# Altium schematic sheet Main.SchDoc: BTL Siuuuu Cao Tần
size A3; Author: Lý Đoàn Dự; DocumentNumber: 1; Revision: 0.0.1; SheetNumber: 1; SheetTotal: 1
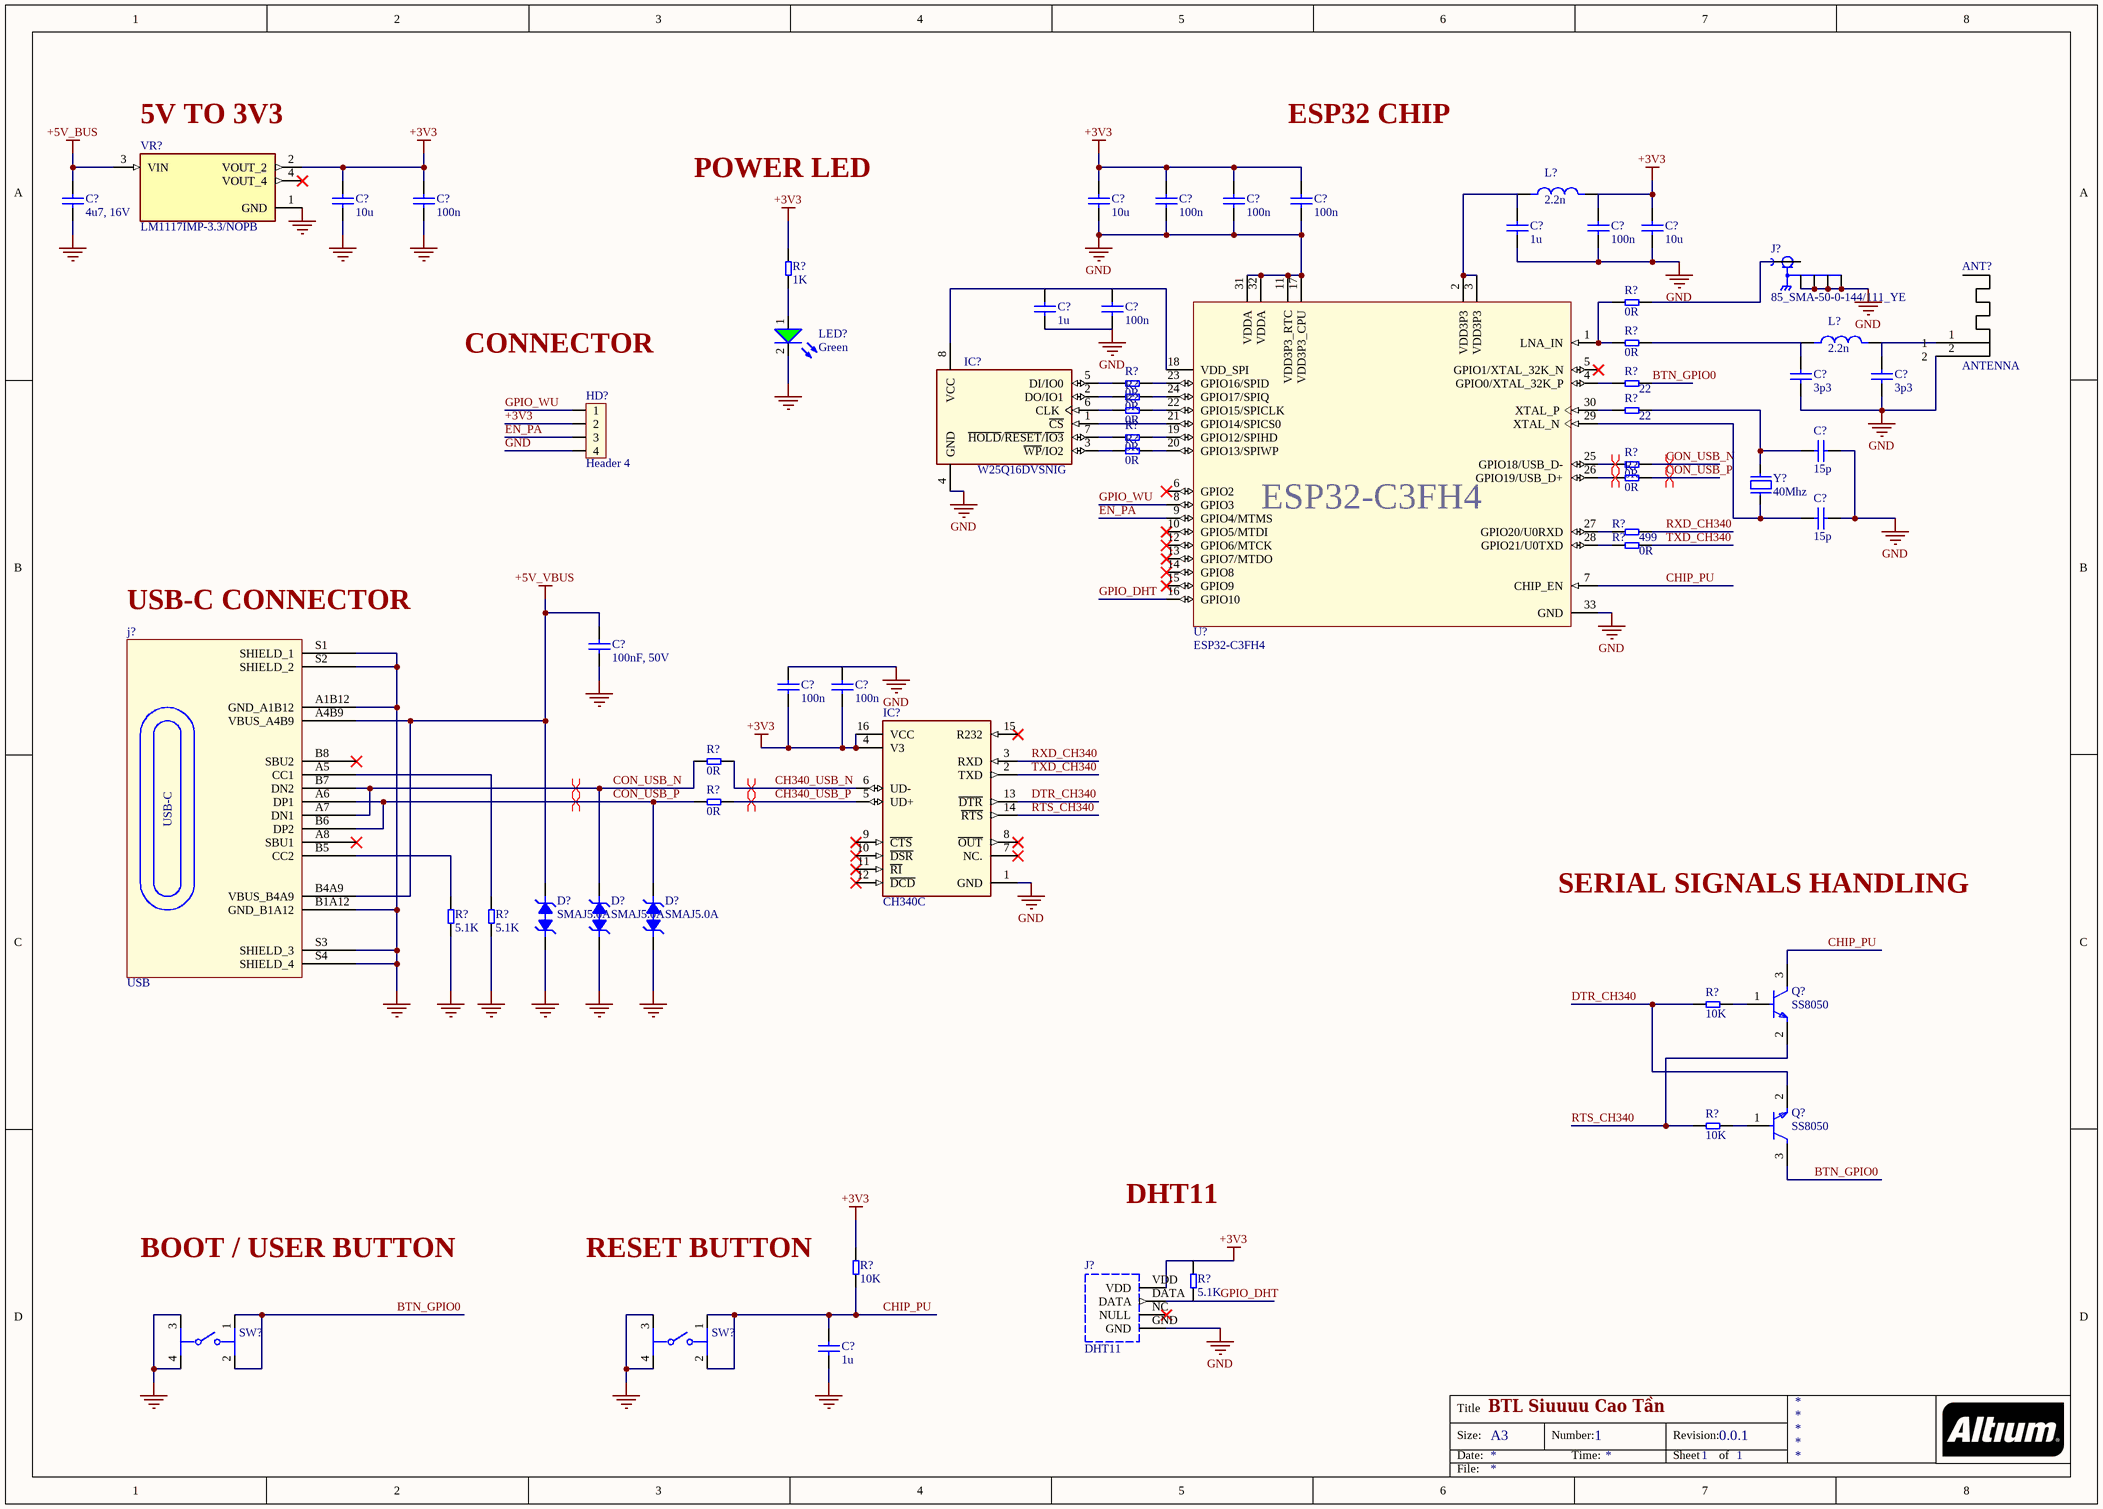
[diagram p0: Main.SchDoc]

## Parts
(Parts that share a designator on the sheet are numbered #1, #2 ... from top to bottom, then left to right.)
ANT?  ANTENNA
C?#1  4u7, 16V  [CAPC1005X55N]
C?#2  10u  [1206_CAP]
C?#3  100n  [1206_CAP]
C?#4  10u  [1206_CAP]
C?#5  100n  [1206_CAP]
C?#6  100n  [1206_CAP]
C?#7  100n  [1206_CAP]
C?#8  1u  [1206_CAP]
C?#9  100n  [1206_CAP]
C?#10  10u  [1206_CAP]
C?#11  1u  [1206_CAP]
C?#12  100n  [1206_CAP]
C?#13  3p3  [0805_CAP]
C?#14  3p3  [0805_CAP]
C?#15  15p  [0805_CAP]
C?#16  15p  [0805_CAP]
C?#17  100nF, 50V  [CAPC1005X55N]
C?#18  100n  [1206_CAP]
C?#19  100n  [1206_CAP]
C?#20  1u  [1206_CAP]
D?#1  SMAJ5.0A  [SMAJ5.0A]
D?#2  SMAJ5.0A  [SMAJ5.0A]
D?#3  SMAJ5.0A  [SMAJ5.0A]
HD?  Header 4  [Header_4]
IC?#1  W25Q16DVSNIG  [W25Q16DVSNIG]
IC?#2  CH340C  [CH340C]
J?#1  85_SMA-50-0-144/111_YE  [SMA]
j?#2  USB  [USB]
J?#3  DHT11  [DHT11]
L?#1  2.2n  [0805_INDUCTOR]
L?#2  2.2n  [0805_INDUCTOR]
LED?  value Green  [Led 0805G]  (hidden comment: LED-0805GVC)
Q?#1  SS8050  [SS8050]
Q?#2  SS8050  [SS8050]
R?#1  1K  [RES_0R0_1206]
R?#2  0R  [RES_0R0_1206]
R?#3  0R  [RES_0R0_1206]
R?#4  0R  [RES_0R0_1206]
R?#5  22  [RES_0R0_1206]
R?#6  0R  [RES_0R0_1206]
R?#7  0R  [RES_0R0_1206]
R?#8  22  [RES_0R0_1206]
R?#9  0R  [RES_0R0_1206]
R?#10  0R  [RES_0R0_1206]
R?#11  0R  [RES_0R0_1206]
R?#12  0R  [RES_0R0_1206]
R?#13  499  [RES_0R0_1206]
R?#14  0R  [RES_0R0_1206]
R?#15  0R  [RES_0R0_1206]
R?#16  0R  [RES_0R0_1206]
R?#17  5.1K  [RES_5K1_0805]
R?#18  5.1K  [RES_5K1_0805]
R?#19  10K  [RES_0R0_1206]
R?#20  10K  [RES_0R0_1206]
R?#21  10K  [RES_0R0_1206]
R?#22  5.1K  [RES_5K1_0805]
SW?#1  (no value)  [Nut nhan 4 chan]
SW?#2  (no value)  [Nut nhan 4 chan]
U?  ESP32-C3FH4  [ESP32-C3FN4]
VR?  LM1117IMP-3.3/NOPB  [LM1117 3V3]
Y?  40Mhz  [Thach Anh 2 chan cam]

## Nets
+3V3: HD?.2 IC?#2.4(V3) IC?#2.16(VCC) J?#3.VDD VR?.2(VOUT_2)
+5V_BUS: C?#1.2 VR?.3(VIN)
+5V_VBUS: C?#17.2 D?#1.2 j?#2.A4B9(VBUS_A4B9) j?#2.B4A9(VBUS_B4A9)
GND: C?#1.1 C?#17.1 D?#1.1 D?#2.1 D?#3.1 HD?.4 IC?#1.4(GND) IC?#2.1(GND) J?#1.G1 J?#1.G2 J?#1.G3 J?#1.G4 j?#2.A1B12(GND_A1B12) j?#2.B1A12(GND_B1A12) j?#2.S1(SHIELD_1) j?#2.S2(SHIELD_2) j?#2.S3(SHIELD_3) j?#2.S4(SHIELD_4) J?#3.GND LED?.2(K) SW?#1.3 SW?#1.4 SW?#2.3 SW?#2.4 U?.11(VDD3P3_RTC) U?.17(VDD3P3_CPU) U?.31(VDDA) U?.32(VDDA) U?.33(GND) VR?.1(GND)
BTN_GPIO0: Q?#2.3(C) SW?#1.1 SW?#1.2
CH340_USB_N: IC?#2.6(UD-)
CH340_USB_P: IC?#2.5(UD+)
CHIP_PU: Q?#1.3(C) SW?#2.1 SW?#2.2 U?.7(CHIP_EN)
CON_USB_N: D?#2.2 j?#2.A7(DN1) j?#2.B7(DN2)
CON_USB_P: D?#3.2 j?#2.A6(DP1) j?#2.B6(DP2)
DTR_CH340: IC?#2.13(~{DTR}) Q?#2.2(E)
EN_PA: HD?.3 U?.9(GPIO4/MTMS)
GPIO_DHT: J?#3.DATA U?.16(GPIO10)
GPIO_WU: HD?.1 U?.8(GPIO3)
RTS_CH340: IC?#2.14(~{RTS}) Q?#1.2(E)
RXD_CH340: IC?#2.3(RXD)
TXD_CH340: IC?#2.2(TXD)
NetIC?#1_1: IC?#1.1(~{CS}) U?.21(GPIO14/SPICS0)
NetIC?#1_8: IC?#1.8(VCC) U?.18(VDD_SPI)
NetU?_2: U?.2(VDD3P3) U?.3(VDD3P3)
NetU?_29: U?.29(XTAL_N) Y?.1

Not connected (* = marked no-connect by the designer): ANT? 1 2; C?#2 1 2; C?#3 1 2; C?#4 1 2; C?#5 1 2; C?#6 1 2; C?#7 1 2; C?#8 1 2; C?#9 1 2; C?#10 1 2; C?#11 1 2; C?#12 1 2; C?#13 1 2; C?#14 1 2; C?#15 1 2; C?#16 1 2; C?#18 1 2; C?#19 1 2; C?#20 1 2; IC?#1 2(DO/IO1) 3(~{WP}/IO2) 5(DI/IO0) 6(CLK) 7(~{HOLD}/~{RESET}/~{IO3}); IC?#2 7(NC.)* 8(~{OUT})* 9(~{CTS})* 10(~{DSR})* 11(~{RI})* 12(~{DCD})* 15(R232)*; J?#1 1; j?#2 A5(CC1) A8(SBU1)* B5(CC2) B8(SBU2)*; J?#3 NC(NULL)*; L?#1 3 4; L?#2 3 4; LED? 1(A); Q?#1 1(B); Q?#2 1(B); R?#1 34 35; R?#2 34 35; R?#3 34 35; R?#4 34 35; R?#5 34 35; R?#6 34 35; R?#7 34 35; R?#8 34 35; R?#9 34 35; R?#10 34 35; R?#11 34 35; R?#12 34 35; R?#13 34 35; R?#14 34 35; R?#15 34 35; R?#16 34 35; R?#17 34 35; R?#18 34 35; R?#19 34 35; R?#20 34 35; R?#21 34 35; R?#22 34 35; U? 1(LNA_IN) 4(GPIO0/XTAL_32K_P) 5(GPIO1/XTAL_32K_N)* 6(GPIO2)* 10(GPIO5/MTDI)* 12(GPIO6/MTCK)* 13(GPIO7/MTDO)* 14(GPIO8)* 15(GPIO9)* 19(GPIO12/SPIHD) 20(GPIO13/SPIWP) 22(GPIO15/SPICLK) 23(GPIO16/SPID) 24(GPIO17/SPIQ) 25(GPIO18/USB_D-) 26(GPIO19/USB_D+) 27(GPIO20/U0RXD) 28(GPIO21/U0TXD) 30(XTAL_P); VR? 4(VOUT_4)*; Y? 2

## Layout directives
differential pair; differential pair class DIFF90: CH340_USB_N, CH340_USB_P, CON_USB_N, CON_USB_P, NetU?_25, NetU?_26

## Notes on the sheet
- (near VR?) 5V TO 3V3
- (near C?#7) ESP32 CHIP
- POWER LED
- (near HD?) CONNECTOR
- (near j?#2) USB-C CONNECTOR
- SERIAL SIGNALS HANDLING
- DHT11
- BOOT / USER BUTTON
- RESET BUTTON
- Title
- Size:
- Date:
- A3
- Number:
- Time:
- Revision:
- Sheet
- of
- File:
- (in symbol USB) USB-C

## Library data of the parts
C?#1 = CL05A475MO5NUNC: CAP CER 4.7UF 16V X5R 0402; Manufacturer: Samsung; Dielectric Material: Ceramic; Multilayer: Yes; Tolerance  (fill in as +-): 20%; Supplier: Digikey; Supplier Part Number: 1276-6836-1-ND; Manufacturer Part Number: CL05A475MO5NUNC; RoHS: Yes; Category: Ceramic Capacitors; Stock: 647617; Pricing: 1=0.44, 10=0.293, 50=0.216, 100=0.1759, 500=0.13888, 1000=0.11727, 2500=0.1111, 5000=0.10493 (USD); Mounting Technology: Surface Mount; Pins: 2; Package Shape: Rectangular; Case/Package: 0402; Terminal Finish: Nickel; Min Operating Temperature: -55°C; Max Operating Temperature: 85°C; JESD-609 Code: e3; Value: 4.7uF; Capacitor Type: Ceramic; Package Style: SMTMeter; Packaging: Tape and Reel; Tolerance (fill in as +-): 20%; Rated DC Voltage (URdc): 16V; Temperature Characteristics Code: X5R; Termination: Wraparound; Length: 1mm; Width: 0.5mm; Height: 0.7mm; Reach SVHC Compliant: Yes; RoHS Compliant: Yes; ComponentLink1URL: https://datasheet.ciiva.com:443/pdfs/VipMasterIC/IC/SEMS/SEMS-S-A0008384515/SEMS-S-A0008898881-1.pdf?src-supplier=IHS+Markit; ComponentLink1Description: https://datasheet.ciiva.com:443/pdfs/VipMasterIC/IC/SEMS/SEMS-S-A0008384515/SEMS-S-A0008898881-1.pdf?src-supplier=IHS+Markit; ComponentLink2URL: http://www.farnell.com/datasheets/2710653.pdf?src-supplier=Farnell; ComponentLink2Description: http://www.farnell.com/datasheets/2710653.pdf?src-supplier=Farnell; ComponentLink3URL: http://www.samsungsem.com/kr/support/product-search/mlcc/CL05A475MO5NUNC.jsp?src-supplier=Digikey; ComponentLink3Description: http://www.samsungsem.com/kr/support/product-search/mlcc/CL05A475MO5NUNC.jsp?src-supplier=Digikey; ComponentLink4URL: http://www.farnell.com/datasheets/2710653.pdf?src-supplier=Newark; ComponentLink4Description: http://www.farnell.com/datasheets/2710653.pdf?src-supplier=Newark; ComponentLink5URL: http://www.farnell.com/datasheets/2710653.pdf?src-supplier=Element14; ComponentLink5Description: http://www.farnell.com/datasheets/2710653.pdf?src-supplier=Element14; ComponentLink6URL: https://datasheet.octopart.com/CL05A475MO5NUNC-Samsung-Electro-Mechanics-datasheet-123102911.pdf?src-supplier=Future+Electronics; ComponentLink6Description: https://datasheet.octopart.com/CL05A475MO5NUNC-Samsung-Electro-Mechanics-datasheet-123102911.pdf?src-supplier=Future+Electronics; LCSC Part Number: C318563
C?#2-C?#12 C?#18-C?#20 = CAP_1206
C?#13-C?#16 = CAP_0805
C?#17 = CL05B104KB54PNC: CAP CER 0.1UF 50V X7R 0402; Manufacturer: Samsung; Dielectric Material: Ceramic; Supplier: Digikey; Supplier Part Number: 1276-CL05B104KB54PNCCT-ND; Manufacturer Part Number: CL05B104KB54PNC; RoHS: Yes; Category: Ceramic Capacitors; Stock: 1237875; Pricing: 1=0.1, 10=0.044, 50=0.025, 100=0.0194, 500=0.0146, 1000=0.01147, 2500=0.01043, 5000=0.00959 (USD); Pins: 2; Capacitor Type: Ceramic; RoHS Compliant: Yes; Reach SVHC Compliant: Yes; ComponentLink1URL: https://datasheet.ciiva.com:443/pdfs/VipMasterIC/IC/SEMS/SEMS-S-A0006318249/SEMS-S-A0006320959-1.pdf?src-supplier=IHS+Markit; ComponentLink1Description: https://datasheet.ciiva.com:443/pdfs/VipMasterIC/IC/SEMS/SEMS-S-A0006318249/SEMS-S-A0006320959-1.pdf?src-supplier=IHS+Markit; ComponentLink2URL: https://datasheet.octopart.com/CL05B104KB54PNC-Samsung-datasheet-8326407.pdf?src-supplier=TME; ComponentLink2Description: https://datasheet.octopart.com/CL05B104KB54PNC-Samsung-datasheet-8326407.pdf?src-supplier=TME; LCSC Part Number: C307331
D?#1 D?#2 = AQ3045-01ETG: TVS DIODE 5.3VWM 12VC SOD882; Manufacturer: Littelfuse; Diode Element Material: SILICON; Package Body Material: Plastic; Polarity: Bidirectional; Max Breakdown Voltage: 9V; Min Breakdown Voltage: 6.8V; Diode Type: TRANS VOLTAGE SUPPRESSOR; Non-rep Peak Rev Power Dis-Max: 40W; Number of Elements: 1; Rep Pk Reverse Voltage-Max: 5.3V; Reference Standard: AEC-Q101; Supplier: Digikey; Supplier Part Number: F9321CT-ND; Manufacturer Part Number: AQ3045-01ETG; RoHS: Yes; Category: TVS Diodes; Stock: 21664; Pricing: 1=0.5, 10=0.391, 100=0.2344, 500=0.217, 1000=0.14756, 2000=0.13585, 5000=0.1302 (USD); Pins: 2; Package Shape: Rectangular; Min Operating Temperature: -55°C; Max Operating Temperature: 150°C; Package Style: CHIP CARRIERMeter; Surface Mount: Yes; Technology: AVALANCHE; Terminal Form: No Lead; Terminal Position: BOTTOM; Reach SVHC Compliant: Yes; RoHS Compliant: Yes; ComponentLink1URL: https://datasheet.ciiva.com:443/pdfs/VipMasterIC/IC/LFSI/LFSI-S-A0007892042/LFSI-S-A0007892042-1.pdf?src-supplier=IHS+Markit; ComponentLink1Description: https://datasheet.ciiva.com:443/pdfs/VipMasterIC/IC/LFSI/LFSI-S-A0007892042/LFSI-S-A0007892042-1.pdf?src-supplier=IHS+Markit; ComponentLink2URL: https://www.littelfuse.com/~/media/electronics/datasheets/tvs_diode_arrays/littelfuse_tvs_diode_array_aq3045_datasheet.pdf.pdf?src-supplier=Digikey; ComponentLink2Description: https://www.littelfuse.com/~/media/electronics/datasheets/tvs_diode_arrays/littelfuse_tvs_diode_array_aq3045_datasheet.pdf.pdf?src-supplier=Digikey; ComponentLink3URL: http://www.littelfuse.com/~/media/electronics/datasheets/tvs_diode_arrays/littelfuse_tvs_diode_array_aq3045_datasheet.pdf.pdf?src-supplier=Digikey; ComponentLink3Description: http://www.littelfuse.com/~/media/electronics/datasheets/tvs_diode_arrays/littelfuse_tvs_diode_array_aq3045_datasheet.pdf.pdf?src-supplier=Digikey; LCSC Part Number: C3710326
D?#3 = AQ3045-01ETG: TVS DIODE; Manufacturer: Littelfuse; Diode Element Material: SILICON; Package Body Material: Plastic; Polarity: Bidirectional; Max Breakdown Voltage: 9V; Min Breakdown Voltage: 6.8V; Diode Type: TRANS VOLTAGE SUPPRESSOR; Non-rep Peak Rev Power Dis-Max: 40W; Number of Elements: 1; Rep Pk Reverse Voltage-Max: 5.3V; Reference Standard: AEC-Q101; Supplier: Digikey; Supplier Part Number: F9321CT-ND; Manufacturer Part Number: AQ3045-01ETG; RoHS: Yes; Category: TVS Diodes; Stock: 21664; Pricing: 1=0.5, 10=0.391, 100=0.2344, 500=0.217, 1000=0.14756, 2000=0.13585, 5000=0.1302 (USD); Pins: 2; Package Shape: Rectangular; Min Operating Temperature: -55°C; Max Operating Temperature: 150°C; Package Style: CHIP CARRIERMeter; Surface Mount: Yes; Technology: AVALANCHE; Terminal Form: No Lead; Terminal Position: BOTTOM; Reach SVHC Compliant: Yes; RoHS Compliant: Yes; ComponentLink1URL: https://datasheet.ciiva.com:443/pdfs/VipMasterIC/IC/LFSI/LFSI-S-A0007892042/LFSI-S-A0007892042-1.pdf?src-supplier=IHS+Markit; ComponentLink1Description: https://datasheet.ciiva.com:443/pdfs/VipMasterIC/IC/LFSI/LFSI-S-A0007892042/LFSI-S-A0007892042-1.pdf?src-supplier=IHS+Markit; ComponentLink2URL: https://www.littelfuse.com/~/media/electronics/datasheets/tvs_diode_arrays/littelfuse_tvs_diode_array_aq3045_datasheet.pdf.pdf?src-supplier=Digikey; ComponentLink2Description: https://www.littelfuse.com/~/media/electronics/datasheets/tvs_diode_arrays/littelfuse_tvs_diode_array_aq3045_datasheet.pdf.pdf?src-supplier=Digikey; ComponentLink3URL: http://www.littelfuse.com/~/media/electronics/datasheets/tvs_diode_arrays/littelfuse_tvs_diode_array_aq3045_datasheet.pdf.pdf?src-supplier=Digikey; ComponentLink3Description: http://www.littelfuse.com/~/media/electronics/datasheets/tvs_diode_arrays/littelfuse_tvs_diode_array_aq3045_datasheet.pdf.pdf?src-supplier=Digikey; LCSC Part Number: C3710326
HD? = Header4: Value: Header 4
J?#1 = 85_SMA-50-0-144/111_YE: RF Connectors / Coaxial Connectors, Right Angle Pcb Jack | HUBER+SUHNER 85_SMA-50-0-144/111_YE; SnapEDA_Link: https://www.snapeda.com/parts/85_SMA-50-0-144/111_YE/Huber%252BSuhner/view-part/?ref=snap; Package: None; Value: *; MF: HUBER+SUHNER; MP: 85_SMA-50-0-144/111_YE; Check_prices: https://www.snapeda.com/parts/85_SMA-50-0-144/111_YE/Huber%252BSuhner/view-part/?ref=eda
J?#3 = DHT22: Capacitive-type humidity and temperature module/sensor; MF: Aosong Electronics; SnapEDA_Link: https://www.snapeda.com/parts/DHT22/Aosong+Electronics/view-part/?ref=snap; Package: Package; Value: *; MP: DHT22; Check_prices: https://www.snapeda.com/parts/DHT22/Aosong+Electronics/view-part/?ref=eda
L?#1 L?#2 = Inductor_0805: MF: Abracon; MP: ASMPH-0805-1R0M-T; SnapEDA_Link: https://www.snapeda.com/parts/ASMPH-0805-1R0M-T/Abracon/view-part/?ref=snap; Package: Package; Value: *; Check_prices: https://www.snapeda.com/parts/ASMPH-0805-1R0M-T/Abracon/view-part/?ref=eda
LED? = LED-0805GVC: LED Green 2mA 3V 0805; ComponentLink1Description: Datasheet; ComponentLink1URL: D:\Dropbox\Datasheets\Opto and Illumination\LEDs\SMD LED.pdf; Unit Price: 0.0476
Q?#1 Q?#2 = SS8050-G: TRANS NPN 25V 1.5A SOT23-3; Manufacturer: Comchip; Supplier: Digikey; Supplier Part Number: 641-1790-1-ND; Manufacturer Part Number: SS8050-G; RoHS: Yes; Category: Transistors; Stock: 108568; Pricing: 1=0.29, 10=0.2, 100=0.0978, 500=0.08154, 1000=0.05666 (USD); Reach SVHC Compliant: Yes; RoHS Compliant: Yes; ComponentLink1URL: https://datasheet.ciiva.com:443/pdfs/VipMasterIC/IC/COMC/COMC-S-A0004994192/COMC-S-A0004994192-1.pdf?src-supplier=IHS+Markit; ComponentLink1Description: https://datasheet.ciiva.com:443/pdfs/VipMasterIC/IC/COMC/COMC-S-A0004994192/COMC-S-A0004994192-1.pdf?src-supplier=IHS+Markit; ComponentLink2URL: http://www.comchiptech.com/admin/files/product/SS8050-G RevA181526.pdf?src-supplier=Digikey; ComponentLink2Description: http://www.comchiptech.com/admin/files/product/SS8050-G RevA181526.pdf?src-supplier=Digikey; LCSC Part Number: C164886
R?#1-R?#16 R?#19-R?#21 = RES_0R0_1206
R?#17 R?#18 R?#22 = RES_0805
SW?#1 SW?#2 = PTS645SH50SMTR92LFS: SWITCH TACTILE SPST-NO 0.05A 12V; Manufacturer: ITT C&K; Manufacturer Series: PTS645; Actuator Type: Pushbutton; Contact Current(DC)-Max: 50mA; Contact DC Max Rating R Load: 0.05A@12VDC; Contact Resistance: 0.1mR; Dielectric Withstand Volts: 250VACV; Electrical Life: 100000Cycles; Insulation Resistance: 100GR; PCB Hole Count: 4; Switch Action: MOMENTARY; Switch Function: SPST; Switch Type: Keypad; Body Breadth: 5.9944inch; Body Height: 3.4544mm; Body Length or Diameter: 5.9944mm; Supplier: Digikey; Supplier Part Number: CKN9085CT-ND; Manufacturer Part Number: PTS645SH50SMTR92LFS; RoHS: Yes; Category: Tactile Switches; Stock: 64637; Pricing: 1=0.35, 10=0.337, 25=0.3172, 100=0.2753, 250=0.24972, 500=0.2323 (USD); Mounting Technology: Surface Mount; Terminal Finish: Silver; Min Operating Temperature: -20°C; Max Operating Temperature: 60°C; JESD-609 Code: e4; Contact Voltage(DC)-Max: 12V; Termination: Solder; Terminal Length: 0.138inch; Reach SVHC Compliant: Yes; RoHS Compliant: Yes; ComponentLink1URL: https://datasheet.ciiva.com:443/pdfs/VipMasterIC/IC/CKCI/CKCI-S-A0001796527/CKCI-S-A0001796842-1.pdf?src-supplier=IHS+Markit; ComponentLink1Description: https://datasheet.ciiva.com:443/pdfs/VipMasterIC/IC/CKCI/CKCI-S-A0001796527/CKCI-S-A0001796842-1.pdf?src-supplier=IHS+Markit; ComponentLink2URL: https://datasheet.ciiva.com/29903/getdatasheetpartid-773702-29903807.pdf?src-supplier=Verical; ComponentLink2Description: https://datasheet.ciiva.com/29903/getdatasheetpartid-773702-29903807.pdf?src-supplier=Verical; ComponentLink3URL: https://datasheet.ciiva.com/14920/pts645-14920741.pdf?src-supplier=Digikey; ComponentLink3Description: https://datasheet.ciiva.com/14920/pts645-14920741.pdf?src-supplier=Digikey; ComponentLink4URL: https://datasheet.ciiva.com/22637/1707731-22637356.pdf?src-supplier=Element14; ComponentLink4Description: https://datasheet.ciiva.com/22637/1707731-22637356.pdf?src-supplier=Element14; LCSC Part Number: C221869
VR? = LM1117IMP-3.3/NOPB: 800-mA 15-V linear voltage regulator; MF: Texas Instruments; SnapEDA_Link: https://www.snapeda.com/parts/LM1117IMP-3.3/NOPB/Texas+Instruments/view-part/?ref=snap; Package: SOT-223-4 Texas Instruments; Value: *; MP: LM1117IMP-3.3/NOPB; Check_prices: https://www.snapeda.com/parts/LM1117IMP-3.3/NOPB/Texas+Instruments/view-part/?ref=eda
Y? = Thach Anh 2 chan Cam: Crystal For all Crystal 2pin.; Value: 4Mhz
U? = ESP32-C3FH4: Package: None; Price: None; Value: *; MP: ESP32-C3FH4; Availability: Unavailable